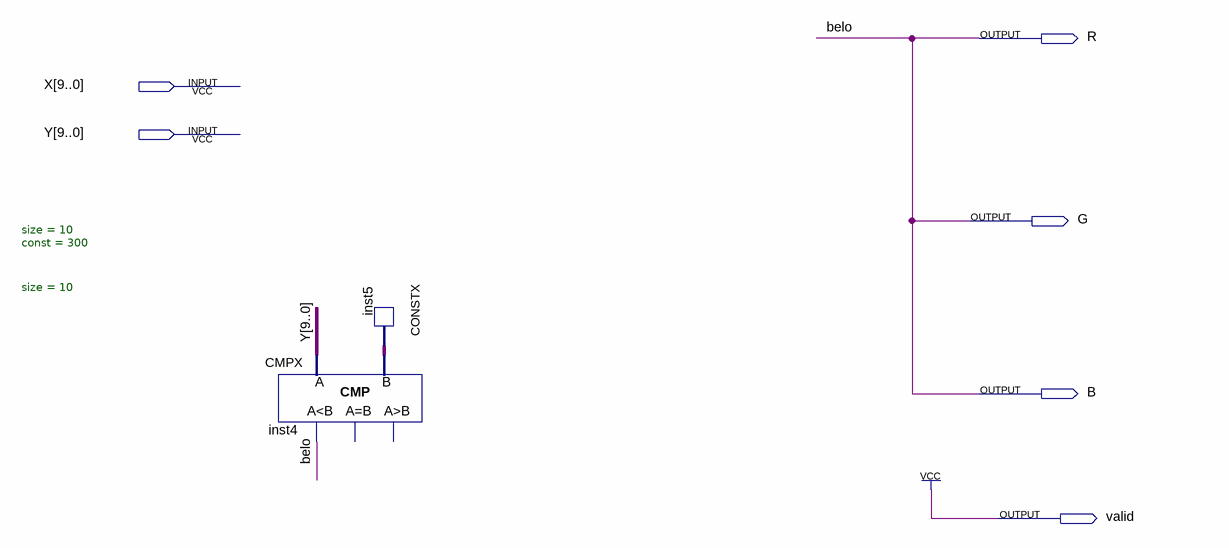
[diagram p0: schematic sheet]
// Quartus schematic layer0.bdf as structural Verilog: 2 symbols, 6 pins
module layer0 (
  input  [9:0] X,
  input  [9:0] Y,
  output R,
  output G,
  output B,
  output valid
);

  wire [9:0] inst5_data;

  CMPX #(.size(10)) inst4 (.A(Y), .B(inst5_data), .ls(B));  // open: eq, gr
  CONSTX #(.size(10), .\const (300)) inst5 (.data(inst5_data));

  assign G = B;
  assign R = B;
  assign valid = 1'b1;

  // Other names for the same wires on the sheet: belo = B
endmodule
